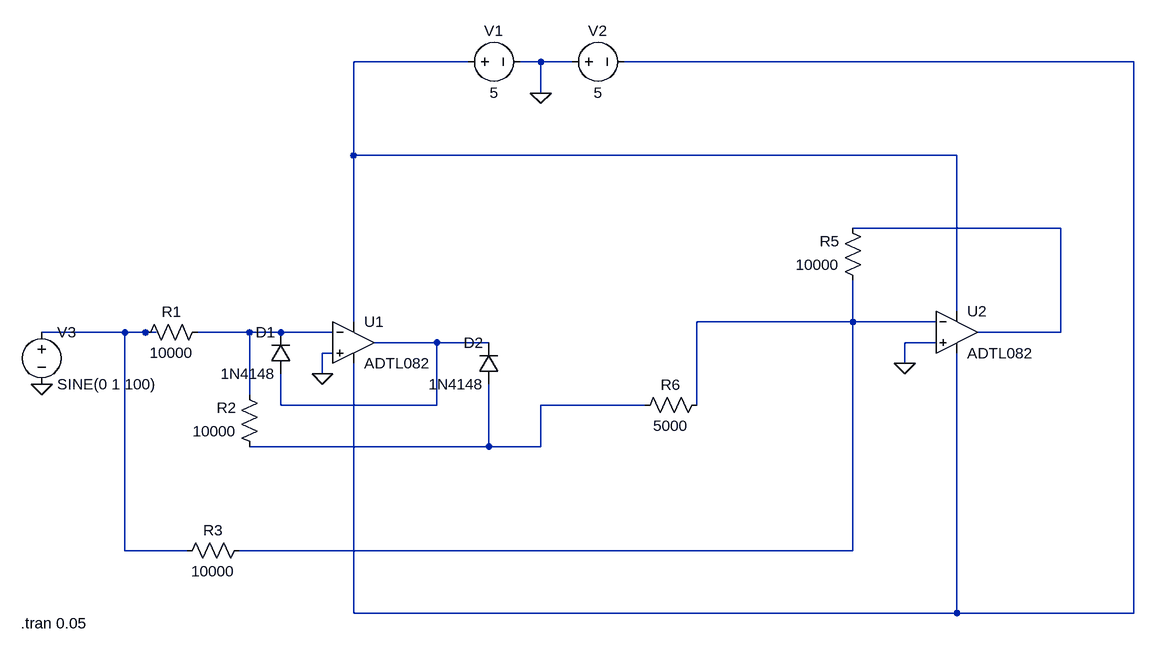
[diagram p0: schematic rectificador.asc]
rectificador.asc, the LTspice schematic file:
Version 4.1
SHEET 1 1220 680
WIRE -16 -336 -192 -336
WIRE 96 -336 64 -336
WIRE 144 -336 96 -336
WIRE 1008 -336 224 -336
WIRE 96 -288 96 -336
WIRE -192 -192 -192 -336
WIRE 736 -192 -192 -192
WIRE 896 -80 576 -80
WIRE 736 48 736 -192
WIRE -192 64 -192 -192
WIRE 576 64 576 0
WIRE 576 64 336 64
WIRE 704 64 576 64
WIRE -544 80 -672 80
WIRE -512 80 -544 80
WIRE -496 80 -512 80
WIRE -352 80 -432 80
WIRE -304 80 -352 80
WIRE -224 80 -304 80
WIRE 896 80 896 -80
WIRE 896 80 768 80
WIRE -64 96 -160 96
WIRE 16 96 -64 96
WIRE 704 96 656 96
WIRE -224 112 -240 112
WIRE 656 128 656 96
WIRE -240 144 -240 112
WIRE -352 176 -352 80
WIRE -304 192 -304 144
WIRE -64 192 -64 96
WIRE -64 192 -304 192
WIRE 256 192 96 192
WIRE 336 192 336 64
WIRE 16 256 16 160
WIRE 16 256 -352 256
WIRE 96 256 96 192
WIRE 96 256 16 256
WIRE -544 416 -544 80
WIRE -448 416 -544 416
WIRE 576 416 576 64
WIRE 576 416 -368 416
WIRE -192 512 -192 128
WIRE 736 512 736 112
WIRE 736 512 -192 512
WIRE 1008 512 1008 -336
WIRE 1008 512 736 512
FLAG 656 128 0
FLAG -240 144 0
FLAG -672 160 0
FLAG 96 -288 0
SYMBOL OpAmps\\ADTL082 -192 32 R0
SYMATTR InstName U1
SYMBOL OpAmps\\ADTL082 736 16 R0
SYMATTR InstName U2
SYMBOL res -416 64 R90
WINDOW 0 0 56 VBottom 2
WINDOW 3 32 56 VTop 2
SYMATTR InstName R1
SYMATTR Value 10000
SYMBOL res -336 272 R180
WINDOW 0 36 76 Left 2
WINDOW 3 36 40 Left 2
SYMATTR InstName R2
SYMATTR Value 10000
SYMBOL res 592 16 R180
WINDOW 0 36 76 Left 2
WINDOW 3 36 40 Left 2
SYMATTR InstName R5
SYMATTR Value 10000
SYMBOL voltage -32 -336 R270
WINDOW 0 32 56 VTop 2
WINDOW 3 -32 56 VBottom 2
WINDOW 123 0 0 Left 0
WINDOW 39 0 0 Left 0
SYMATTR InstName V1
SYMATTR Value 5
SYMBOL voltage 128 -336 R270
WINDOW 0 32 56 VTop 2
WINDOW 3 -32 56 VBottom 2
WINDOW 123 0 0 Left 0
WINDOW 39 0 0 Left 0
SYMATTR InstName V2
SYMATTR Value 5
SYMBOL voltage -672 64 R0
WINDOW 123 0 0 Left 0
WINDOW 39 0 0 Left 0
SYMATTR InstName V3
SYMATTR Value SINE(0 1 100)
SYMBOL res -352 400 R90
WINDOW 0 0 56 VBottom 2
WINDOW 3 32 56 VTop 2
SYMATTR InstName R3
SYMATTR Value 10000
SYMBOL res 352 176 R90
WINDOW 0 0 56 VBottom 2
WINDOW 3 32 56 VTop 2
SYMATTR InstName R6
SYMATTR Value 5000
SYMBOL diode -288 144 R180
WINDOW 0 24 64 Left 2
WINDOW 3 24 0 Left 2
SYMATTR InstName D1
SYMATTR Value 1N4148
SYMBOL diode 32 160 R180
WINDOW 0 24 64 Left 2
WINDOW 3 24 0 Left 2
SYMATTR InstName D2
SYMATTR Value 1N4148
TEXT -704 528 Left 2 !.tran 0.05

The netlist it stands for:
* rectificador.asc
X§U1 0 N006 N001 N002 N007 ADTL082  ; pins In+ In- V+ V- OUT
X§U2 0 N004 N001 N002 N003 ADTL082  ; pins In+ In- V+ V- OUT
R1 N006 N005 10000
R2 N008 N006 10000
R5 N004 N003 10000
V1 N001 0 5
V2 0 N002 5
V3 N005 0 SINE(0 1 100)
R3 N004 N005 10000
R6 N004 N008 5000
D1 N007 N006 1N4148
D2 N008 N007 1N4148
.model D D
.lib standard.dio
.tran 0.05
.lib ADI.lib
.backanno
.end